# Altium schematic sheet MCU.SchDoc
size A4
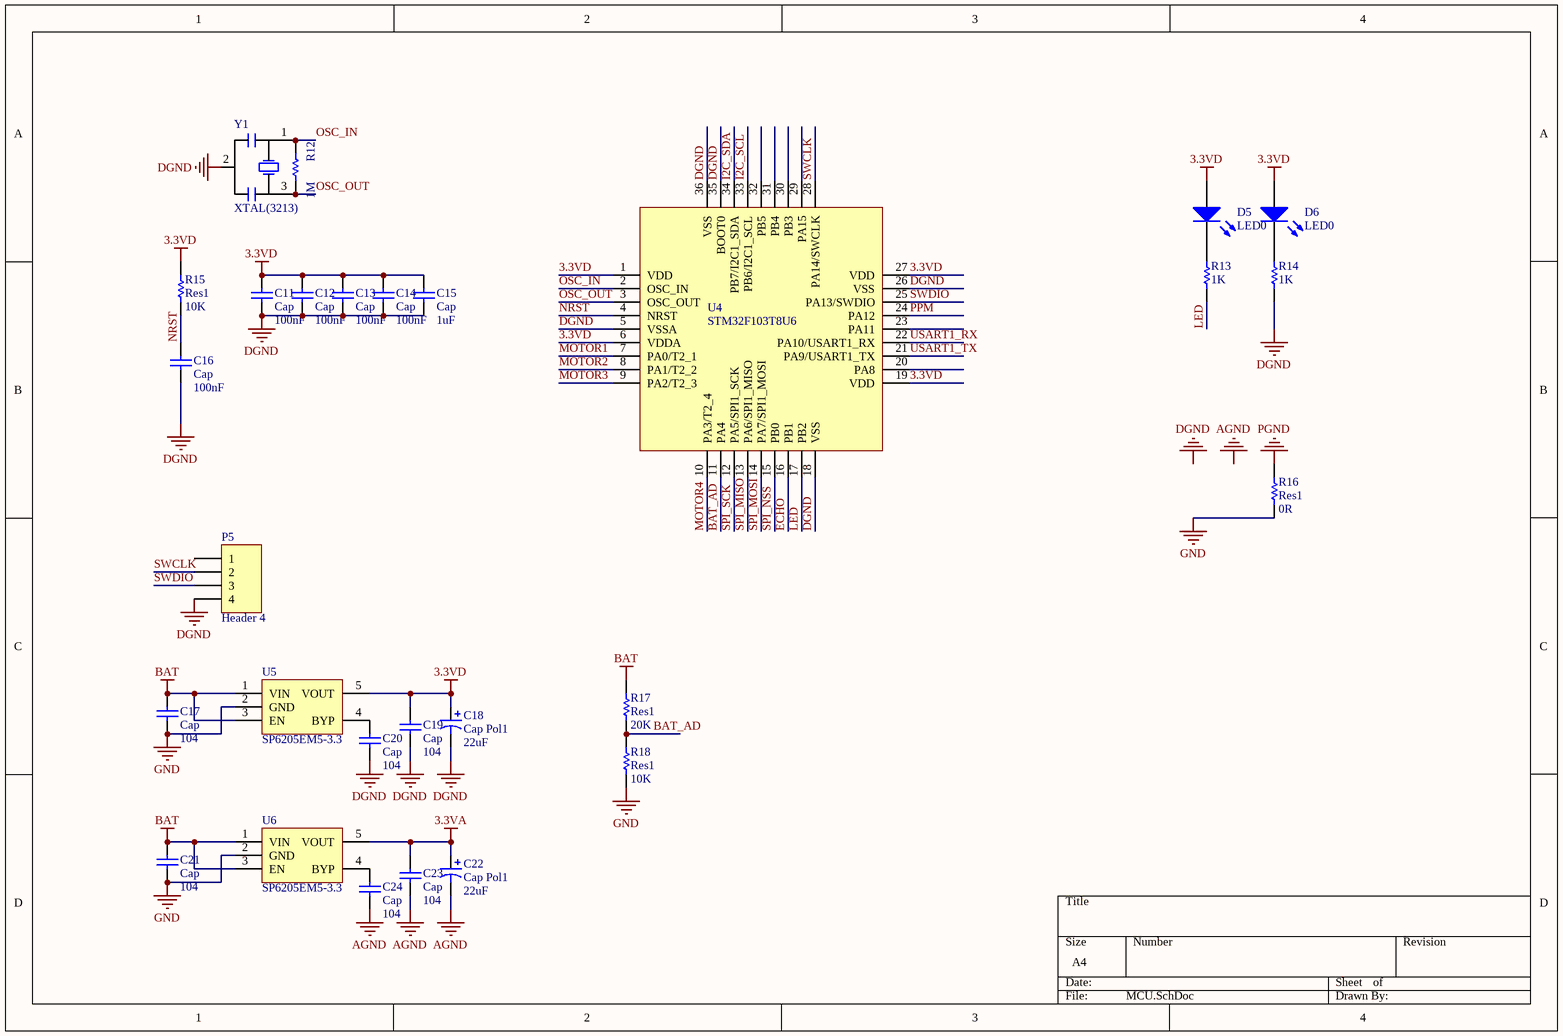
[diagram p0: MCU.SchDoc]

## Parts
C11  Cap  value 100nF  [C0402]
C12  Cap  value 100nF  [C0402]
C13  Cap  value 100nF  [C0402]
C14  Cap  value 100nF  [C0402]
C15  Cap  value 1uF  [C0402]
C16  Cap  value 100nF  [C0402]
C17  Cap  value 104  [C0603]
C18  Cap Pol1  value 22uF  [C0805]
C19  Cap  value 104  [C0402]
C20  Cap  value 104  [C0402]
C21  Cap  value 104  [C0603]
C22  Cap Pol1  value 22uF  [C0805]
C23  Cap  value 104  [C0402]
C24  Cap  value 104  [C0402]
D5  LED0  [0603D]
D6  LED0  [0603D]
P5  Header 4  [1.0*4PIN/SMD]
R12  value 1M  [R0402]  (hidden comment: Res1)
R13  value 1K  [R0603]  (hidden comment: Res1)
R14  value 1K  [R0603]  (hidden comment: Res1)
R15  Res1  value 10K  [R0402]
R16  Res1  value 0R  [0805R]
R17  Res1  value 20K  [R0402]
R18  Res1  value 10K  [R0402]
U4  STM32F103T8U6  [VFQFPN36]
U5  SP6205EM5-3.3  [SOT-23-5]
U6  SP6205EM5-3.3  [SOT-23-5]
Y1  XTAL(3213)  [Y3213]

## Nets
3.3VA: C22.1 C23.2 U6.5(VOUT)
3.3VD: C11.2 C12.2 C13.2 C14.2 C15.2 C18.1 C19.2 D5.1(A) D6.1(A) R15.2 U4.1(VDD) U4.6(VDDA) U4.19(VDD) U4.27(VDD) U5.5(VOUT)
AGND: C22.2 C23.1 C24.1
BAT: C17.2 C21.2 R17.2 U5.1(VIN) U5.3(EN) U6.1(VIN) U6.3(EN)
DGND: C11.1 C12.1 C13.1 C14.1 C15.1 C16.1 C18.2 C19.1 C20.1 P5.4 R14.2 U4.5(VSSA) U4.18(VSS) U4.26(VSS) U4.35(BOOT0) U4.36(VSS) Y1.2(GND)
GND: C17.1 C21.1 R16.1 R18.1 U5.2(GND) U6.2(GND)
PGND: R16.2
BAT_AD: R17.1 R18.2 U4.11(PA4)
ECHO: U4.16(PB1)
I2C_SCL: U4.33(PB6/I2C1_SCL)
I2C_SDA: U4.34(PB7/I2C1_SDA)
LED: R13.2 U4.17(PB2)
MOTOR1: U4.7(PA0/T2_1)
MOTOR2: U4.8(PA1/T2_2)
MOTOR3: U4.9(PA2/T2_3)
MOTOR4: U4.10(PA3/T2_4)
NRST: C16.2 R15.1 U4.4(NRST)
OSC_IN: R12.2 U4.2(OSC_IN) Y1.1(OSC1)
OSC_OUT: R12.1 U4.3(OSC_OUT) Y1.3(OSC2)
PPM: U4.24(PA12)
SPI_MISO: U4.13(PA6/SPI1_MISO)
SPI_MOSI: U4.14(PA7/SPI1_MOSI)
SPI_NSS: U4.15(PB0)
SPI_SCK: U4.12(PA5/SPI1_SCK)
SWCLK: P5.2 U4.28(PA14/SWCLK)
SWDIO: P5.3 U4.25(PA13/SWDIO)
USART1_RX: U4.22(PA10/USART1_RX)
USART1_TX: U4.21(PA9/USART1_TX)
NetC20_2: C20.2 U5.4(BYP)
NetC24_2: C24.2 U6.4(BYP)
NetD5_2: D5.2(K) R13.1
NetD6_2: D6.2(K) R14.1

Not connected (* = marked no-connect by the designer): P5 1; U4 20(PA8) 23(PA11) 29(PA15) 30(PB3) 31(PB4) 32(PB5)

## Notes on the sheet
- Labels drawn without touching a wire or pin: AGND, DGND

## Library data of the parts
C11-C17 C19-C21 C23 C24 = Cap: Capacitor; Published: 8-Jun-2000; LatestRevisionDate: 17-Jul-2002; LatestRevisionNote: Re-released for DXP Platform.; PackageReference: RAD-0.3; Publisher: Altium Limited
C18 C22 = Cap Pol1: Polarized Capacitor (Radial); Published: 8-Jun-2000; LatestRevisionDate: 17-Jul-2002; LatestRevisionNote: Re-released for DXP Platform.; PackageReference: RB7.6-15; Publisher: Altium Limited
D5 D6 = LED0: Typical INFRARED GaAs LED; Published: 8-Jun-2000; LatestRevisionDate: 08-Jul-2005; LatestRevisionNote: Mech Layer 1 removed.; PackageReference: LED-0; Publisher: Altium Limited; PackageDescription: LED; 2 Leads
P5 = Header 4: Header, 4-Pin; LatestRevisionDate: 17-Jul-2002; LatestRevisionNote: Re-released for DXP Platform.; Publisher: Altium Limited
R12-R18 = Res1: Resistor; Published: 8-Jun-2000; LatestRevisionDate: 17-Jul-2002; LatestRevisionNote: Re-released for DXP Platform.; PackageReference: AXIAL-0.3; Publisher: Altium Limited; PackageDescription: Axial Device, Thru-Hole; 2 Leads; 0.3 in Pin Spacing
U5 U6 = SP6205: AD3330
Y1 = XTAL(3213): Crystal Oscillator; Published: 8-Jun-2000; LatestRevisionDate: 17-Jul-2002; LatestRevisionNote: Re-released for DXP Platform.; PackageReference: R38; Publisher: Altium Limited